# Altium schematic sheet ADC.SchDoc: AD4080
size A3; Author: M.Beldyga; CompanyName: Aescape, Inc.; DrawnBy: M.Beldyga; Organization: Aescape, Inc.; Address1: Aescape, Inc.; Address2: 581 6th Ave, New York, NY 10011; Address3: michal@aescape.com; SheetNumber: 2; SheetTotal: 10; ModifiedBy: -; CheckedDate: -; Title2: 20b 40Msps ADC; DivGrp: Aescape, Inc.; Designer: M.Beldyga; ModifiedDate: -; ProjectName: Sensor Box
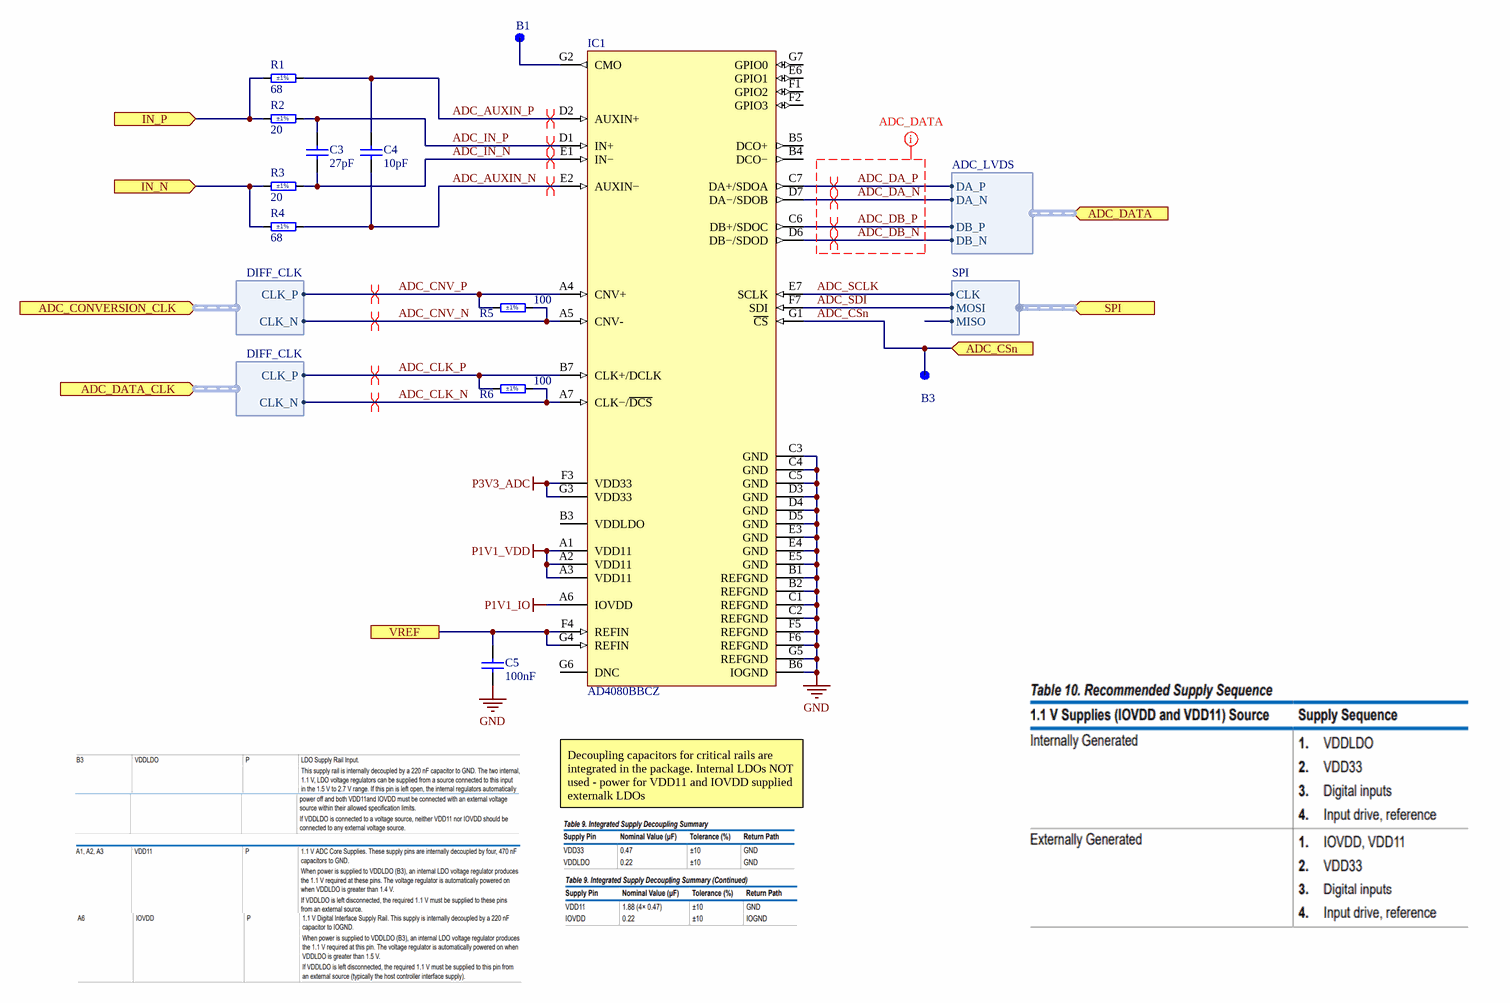
[diagram p0: ADC.SchDoc]

## Parts
B1  SMD Pad  [C100]  (value not drawn)  (no BOM)
B3  SMD Pad  [C100]  (value not drawn)  (no BOM)
C3  27pF  [CAPC1005X55N]
C4  10pF  [CAPC1005X55N]
C5  100nF  [CAPC1005X55N]
IC1  AD4080BBCZ  [BGA49C65P7X7_500X500X138]
R1  68  Tolerance: ±1%  [RESC1005X40N]
R2  20  Tolerance: ±1%  [RESC1005X40N]
R3  20  Tolerance: ±1%  [RESC1005X40N]
R4  68  Tolerance: ±1%  [RESC1005X40N]
R5  100  Tolerance: ±1%  [RESC1005X40N]
R6  100  Tolerance: ±1%  [RESC1005X40N]

## Ports
ADC_CONVERSION_CLK (in, harness DIFF_CLK), ADC_CSn (in), ADC_DATA (in, harness ADC_LVDS), ADC_DATA_CLK (in, harness DIFF_CLK), IN_N (in), IN_P (in), SPI (in, harness SPI), VREF

## Harnesses
ADC_LVDS: DA_P, DA_N, DB_P, DB_N
DIFF_CLK: CLK_P, CLK_N
SPI: CLK, MOSI, MISO

## Nets
GND: C5.1 IC1.B1(REFGND) IC1.B2(REFGND) IC1.B6(IOGND) IC1.C1(REFGND) IC1.C2(REFGND) IC1.C3(GND) IC1.C4(GND) IC1.C5(GND) IC1.D3(GND) IC1.D4(GND) IC1.D5(GND) IC1.E3(GND) IC1.E4(GND) IC1.E5(GND) IC1.F5(REFGND) IC1.F6(REFGND) IC1.G5(REFGND)
P1V1_IO: IC1.A6(IOVDD)
P1V1_VDD: IC1.A1(VDD11) IC1.A2(VDD11) IC1.A3(VDD11)
P3V3_ADC: IC1.F3(VDD33) IC1.G3(VDD33)
ADC_AUXIN_N: C4.1 IC1.E2(AUXIN−) R4.2
ADC_AUXIN_P: C4.2 IC1.D2(AUXIN+) R1.2
ADC_CLK_N: IC1.A7(CLK−/~{DCS}) R6.2 ; port ADC_DATA_CLK.CLK_N
ADC_CLK_P: IC1.B7(CLK+/DCLK) R6.1 ; port ADC_DATA_CLK.CLK_P
ADC_CNV_N: IC1.A5(CNV-) R5.2 ; port ADC_CONVERSION_CLK.CLK_N
ADC_CNV_P: IC1.A4(CNV+) R5.1 ; port ADC_CONVERSION_CLK.CLK_P
ADC_CSn: B3.1 IC1.G1(~{CS}) ; port ADC_CSn
ADC_DA_N: IC1.D7(DA−/SDOB) ; port ADC_DATA.DA_N
ADC_DA_P: IC1.C7(DA+/SDOA) ; port ADC_DATA.DA_P
ADC_DB_N: IC1.D6(DB−/SDOD) ; port ADC_DATA.DB_N
ADC_DB_P: IC1.C6(DB+/SDOC) ; port ADC_DATA.DB_P
ADC_IN_N: C3.1 IC1.E1(IN−) R3.2
ADC_IN_P: C3.2 IC1.D1(IN+) R2.2
ADC_SCLK: IC1.E7(SCLK) ; port SPI.CLK
ADC_SDI: IC1.F7(SDI) ; port SPI.MOSI
IN_N: R3.1 R4.1 ; port IN_N
IN_P: R1.1 R2.1 ; port IN_P
VREF: C5.2 IC1.F4(REFIN) IC1.G4(REFIN) ; port VREF
NetB1_1: B1.1 IC1.G2(CMO)

Not connected (* = marked no-connect by the designer): IC1 B3(VDDLDO) B4(DCO−) B5(DCO+) E6(GPIO1) F1(GPIO2) F2(GPIO3) G6(DNC) G7(GPIO0)

## Layout directives
differential pair; net class ADC_IN: ADC_AUXIN_N, ADC_AUXIN_P, ADC_IN_N, ADC_IN_P
differential pair; net class D100: ADC_CLK_N, ADC_CLK_P, ADC_CNV_N, ADC_CNV_P, ADC_DA_N, ADC_DA_P, ADC_DB_N, ADC_DB_P
net class ADC_DATA: ADC_DA_N, ADC_DA_P, ADC_DB_N, ADC_DB_P

## Notes on the sheet
- Decoupling capacitors for critical rails are integrated in the package. Internal LDOs NOT used - power for VDD11 and IOVDD supplied externalk LDOs
- Project/Equipment
- Document
- Designer
- Drawn by
- Check.by
- Contact
- File
- Last Mod.
- Print Date
- Sheet
- Size
- A3
- of
- Rev

## Library data of the parts
B1 B3 = SMD_PAD_D1MM: Pad; Part Description: 1mm Diameter SMD Pad; Mounted: No; Part Number: SMD_PAD_D1MM; Component Type: Standard (No BOM); Pin Count: 1; Family: SMD Pad; Socket: No; SMD: Yes; Sense: No; Status: None; ComponentHeight: 0mm; HelpURL: Undefined; Author: CERN DEM JLC; CreateDate: 10/10/2017; LatestRevisionDate: 10/10/2017; PackageDescription: 1mm Diameter SMD Pad
C3 = CC0402_27PF_50V_5%_C0G: Non-polarised capacitor; Part Description: SMD Multilayer Chip Ceramic Capacitor; Manufacturer: GENERIC; Manufacturer1 Part Number: C0402C270J5GACTU; Voltage: 50V; TC: C0G/NP0; Tolerance: ±5%; Part Number: CC0402_27PF_50V_5%_C0G; Component Kind: Standard; Component Type: Standard; Pin Count: 2; Value: 27pF; Status: Preferred; Manufacturer Part Number: CC0402_27PF_50V_5%_C0G; Case: 0402; Mounted: Yes; Socket: No; SMD: Yes; Sense: No; Manufacturer1 Example: KEMET; Manufacturer1 ComponentHeight: 0.55mm; HelpURL: \\cern.ch\dfs\Applications\Altium\Datasheets\CC0402_C0G_KEMET_(Commercial Grade).pdf; Author: CERN DEM JLC; CreateDate: 10/25/2012; LatestRevisionDate: 4/22/2015
C4 = CC0402_10PF_50V_5%_C0G: Non-polarised capacitor; Part Description: SMD Multilayer Chip Ceramic Capacitor; Manufacturer: GENERIC; Manufacturer1 Part Number: C0402C100J5GACTU; Voltage: 50V; TC: C0G/NP0; Tolerance: ±5%; Part Number: CC0402_10PF_50V_5%_C0G; Component Kind: Standard; Component Type: Standard; Pin Count: 2; Value: 10pF; Status: Preferred; Manufacturer Part Number: CC0402_10PF_50V_5%_C0G; Case: 0402; Mounted: Yes; Socket: No; SMD: Yes; Sense: No; Manufacturer1 Example: KEMET; Manufacturer1 ComponentHeight: 0.55mm; HelpURL: \\cern.ch\dfs\Applications\Altium\Datasheets\CC0402_C0G_KEMET_(Commercial Grade).pdf; Author: CERN DEM JLC; CreateDate: 12/3/2007; LatestRevisionDate: 4/22/2015
C5 = CC0402_100NF_50V_10%_X7R: Non-polarised capacitor; Part Description: SMD Multilayer Chip Ceramic Capacitor; Manufacturer: GENERIC; Manufacturer1 Part Number: GRM155R71H104KE14D; Voltage: 50V; TC: X7R; Tolerance: ±10%; Part Number: CC0402_100NF_50V_10%_X7R; Component Kind: Standard; Component Type: Standard; Pin Count: 2; Value: 100nF; Status: None; Manufacturer Part Number: CC0402_100NF_50V_10%_X7R; Case: 0402; Mounted: Yes; Socket: No; SMD: Yes; Sense: No; Manufacturer1 Example: MURATA; Manufacturer1 ComponentHeight: 0.55mm; HelpURL: \\cern.ch\dfs\Applications\Altium\Datasheets\CC0402_MURATA_GRM155R71H104KE14D.pdf; Author: CERN DEM MR; CreateDate: 6/30/2017; LatestRevisionDate: 6/30/2017
IC1 = AD4080BBCZ: 20-Bit, 40 MSPS, Differential SAR ADC; Manufacturer: Analog Devices; Part Number: AD4080BBCZ; Component Kind: Standard; Component Type: Standard; Device: AD4080BBCZ; PackageDescription: BGA, 49-Leads, Body 5.00x5.00mmx1.38mm, Pitch 0.65mm; Part Description: 20-Bit, 40 MSPS, Differential SAR ADC; Manufacturer Part Number: AD4080BBCZ; Pin Count: 49; Case: BGA; Status: Active; Author: Michal Beldyga; CreateDate: 1/31/2025; LastRevision: 1/31/2025
R1 R4 = R0402_68R_1%_0.0625W_100PPM: Resistor - 1%; Part Description: General Purpose Thick Film Chip Resistor; Manufacturer: GENERIC; Manufacturer1 Part Number: 232270676809L; TC: ±100ppm/°C; PressFit: No; Part Number: R0402_68R_1%_0.0625W_100PPM; Component Kind: Standard; Component Type: Standard; Pin Count: 2; Value: 68; Status: Not Recommended; Power: 0.0625W; Manufacturer Part Number: R0402_68R_1%_0.0625W_100PPM; Case: 0402; Mounted: Yes; Sense: No; Socket: No; SMD: Yes; Manufacturer1 Example: YAGEO PHYCOMP; Manufacturer1 ComponentHeight: 0.4mm; HelpURL: \\cern.ch\dfs\Applications\Altium\Datasheets\R0402_Phycomp_RC0402.pdf; Author: CERN DEM JLC; CreateDate: 12/3/2007; LatestRevisionDate: 10/17/2012
R2 R3 = R0402_20R_1%_0.0625W_100PPM: Resistor - 1%; Part Description: General Purpose Thick Film Chip Resistor; Manufacturer: GENERIC; Manufacturer1 Part Number: 232270672009L; TC: ±100ppm/°C; PressFit: No; Part Number: R0402_20R_1%_0.0625W_100PPM; Component Kind: Standard; Component Type: Standard; Pin Count: 2; Value: 20; Status: Not Recommended; Power: 0.0625W; Manufacturer Part Number: R0402_20R_1%_0.0625W_100PPM; Case: 0402; Mounted: Yes; Sense: No; Socket: No; SMD: Yes; Manufacturer1 Example: YAGEO PHYCOMP; Manufacturer1 ComponentHeight: 0.4mm; HelpURL: \\cern.ch\dfs\Applications\Altium\Datasheets\R0402_Phycomp_RC0402.pdf; Author: CERN DEM JLC; CreateDate: 12/3/2007; LatestRevisionDate: 10/17/2012
R5 R6 = R0402_100R_1%_0.1W_100PPM: Resistor - 1%; Part Description: General Purpose Thick Film Chip Resistor; Manufacturer: GENERIC; Manufacturer Part Number: R0402_100R_1%_0.1W_100PPM_50V; Manufacturer1 Part Number: ERJ2RKF1000X; Power: 0.1W; TC: ±100ppm/°C; Voltage: 50V; PressFit: No; Part Number: R0402_100R_1%_0.1W_100PPM; Component Kind: Standard; Component Type: Standard; Pin Count: 2; Value: 100; Status: Not Recommended; Case: 0402; Mounted: Yes; Sense: No; Socket: No; SMD: Yes; Manufacturer1 Example: PANASONIC; Manufacturer1 ComponentHeight: 0.4mm; HelpURL: \\cern.ch\dfs\Applications\Altium\Datasheets\R0402_PANASONIC_ERJ2RK.pdf; Author: CERN DEM JLC; CreateDate: 12/12/2013; LatestRevisionDate: 3/3/2015